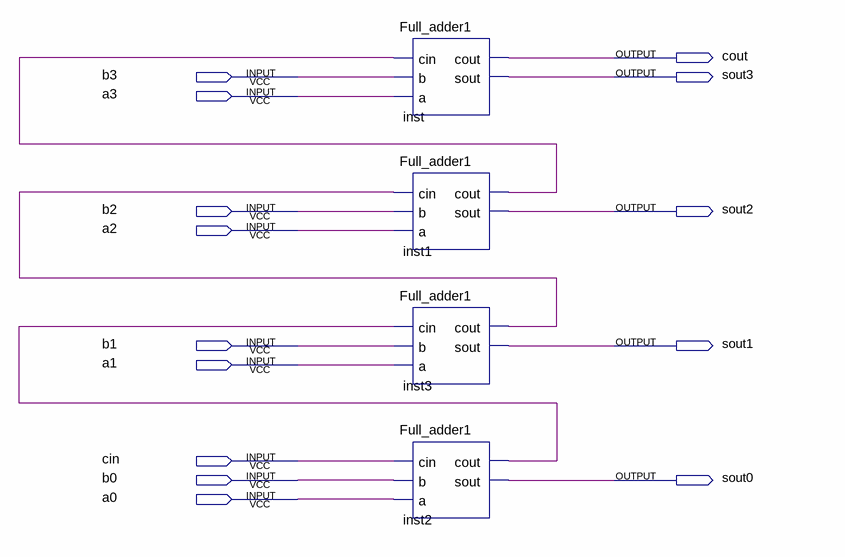
[diagram p0: schematic sheet]
// Quartus schematic Full_adder4.bdf as structural Verilog: 4 symbols, 14 pins
module Full_adder4 (
  input  b3,
  input  a3,
  input  b2,
  input  a2,
  input  b1,
  input  a1,
  input  cin,
  input  b0,
  input  a0,
  output cout,
  output sout3,
  output sout2,
  output sout1,
  output sout0
);

  wire inst1_cout, inst2_cout, inst3_cout;

  Full_adder1 inst (.cin(inst1_cout), .b(b3), .a(a3), .cout(cout), .sout(sout3));
  Full_adder1 inst1 (.cin(inst3_cout), .b(b2), .a(a2), .cout(inst1_cout), .sout(sout2));
  Full_adder1 inst3 (.cin(inst2_cout), .b(b1), .a(a1), .cout(inst3_cout), .sout(sout1));
  Full_adder1 inst2 (.cin(cin), .b(b0), .a(a0), .cout(inst2_cout), .sout(sout0));
endmodule
